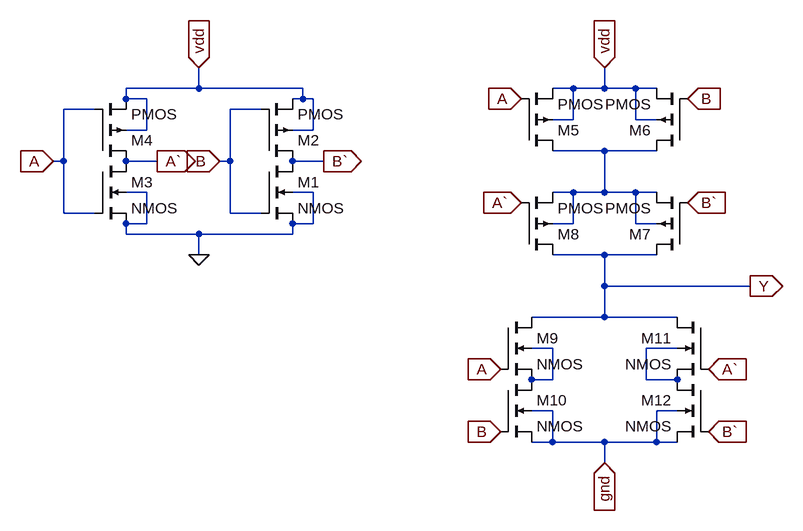
[diagram p0: schematic xor.asc]
xor.asc, the LTspice schematic file:
Version 4
SHEET 1 880 680
WIRE -320 -160 -320 -192
WIRE -320 -160 -432 -160
WIRE -160 -160 -320 -160
WIRE 256 -160 224 -160
WIRE 304 -160 304 -192
WIRE 304 -160 256 -160
WIRE 352 -160 304 -160
WIRE 384 -160 352 -160
WIRE -432 -144 -432 -160
WIRE -400 -144 -432 -144
WIRE -160 -144 -160 -160
WIRE -160 -144 -176 -144
WIRE -144 -144 -160 -144
WIRE -480 -128 -528 -128
WIRE -224 -128 -272 -128
WIRE 256 -112 256 -160
WIRE 256 -112 224 -112
WIRE 352 -112 352 -160
WIRE 384 -112 352 -112
WIRE -400 -96 -400 -144
WIRE -400 -96 -432 -96
WIRE -144 -96 -144 -144
WIRE -144 -96 -176 -96
WIRE 304 -64 224 -64
WIRE 384 -64 304 -64
WIRE -528 -48 -528 -128
WIRE -528 -48 -544 -48
WIRE -384 -48 -432 -48
WIRE -272 -48 -272 -128
WIRE -272 -48 -288 -48
WIRE -128 -48 -176 -48
WIRE -400 0 -432 0
WIRE -144 0 -176 0
WIRE 256 0 224 0
WIRE 304 0 304 -64
WIRE 304 0 256 0
WIRE 352 0 304 0
WIRE 384 0 352 0
WIRE -528 32 -528 -48
WIRE -480 32 -528 32
WIRE -272 32 -272 -48
WIRE -224 32 -272 32
WIRE -400 48 -400 0
WIRE -400 48 -432 48
WIRE -144 48 -144 0
WIRE -144 48 -176 48
WIRE 256 48 256 0
WIRE 256 48 224 48
WIRE 352 48 352 0
WIRE 384 48 352 48
WIRE -432 64 -432 48
WIRE -320 64 -432 64
WIRE -176 64 -176 48
WIRE -176 64 -320 64
WIRE -320 96 -320 64
WIRE 304 96 224 96
WIRE 384 96 304 96
WIRE 304 144 304 96
WIRE 528 144 304 144
WIRE 304 192 304 144
WIRE 304 192 192 192
WIRE 416 192 304 192
WIRE 224 240 192 240
WIRE 416 240 368 240
WIRE 224 288 224 240
WIRE 224 288 192 288
WIRE 368 288 368 240
WIRE 416 288 368 288
WIRE 224 336 192 336
WIRE 416 336 384 336
WIRE 224 384 224 336
WIRE 224 384 192 384
WIRE 304 384 224 384
WIRE 384 384 384 336
WIRE 384 384 304 384
WIRE 416 384 384 384
WIRE 304 416 304 384
FLAG -384 -48 A`
IOPIN -384 -48 Out
FLAG -128 -48 B`
IOPIN -128 -48 Out
FLAG 304 -192 vdd
IOPIN 304 -192 In
FLAG 176 -144 A
IOPIN 176 -144 In
FLAG -320 -192 vdd
IOPIN -320 -192 In
FLAG -320 96 0
FLAG -544 -48 A
IOPIN -544 -48 In
FLAG -288 -48 B
IOPIN -288 -48 In
FLAG 528 144 Y
IOPIN 528 144 Out
FLAG 432 -144 B
IOPIN 432 -144 In
FLAG 144 368 B
IOPIN 144 368 In
FLAG 176 16 A`
IOPIN 176 16 In
FLAG 464 272 A`
IOPIN 464 272 In
FLAG 432 16 B`
IOPIN 432 16 In
FLAG 464 368 B`
IOPIN 464 368 In
FLAG 144 272 A
IOPIN 144 272 In
FLAG 304 416 gnd
IOPIN 304 416 In
SYMBOL nmos4 -224 -48 R0
SYMATTR InstName M1
SYMBOL pmos4 -224 -48 M180
SYMATTR InstName M2
SYMBOL nmos4 -480 -48 R0
SYMATTR InstName M3
SYMBOL pmos4 -480 -48 M180
SYMATTR InstName M4
SYMBOL pmos4 176 -64 M180
SYMATTR InstName M5
SYMBOL pmos4 432 -64 R180
SYMATTR InstName M6
SYMBOL pmos4 432 96 R180
SYMATTR InstName M7
SYMBOL pmos4 176 96 M180
SYMATTR InstName M8
SYMBOL nmos4 144 192 R0
SYMATTR InstName M9
SYMBOL nmos4 144 288 R0
SYMATTR InstName M10
SYMBOL nmos4 464 192 M0
SYMATTR InstName M11
SYMBOL nmos4 464 288 M0
SYMATTR InstName M12

The netlist it stands for:
* xor.asc
M1 B` B 0 0 NMOS
M2 B` B vdd vdd PMOS
M3 A` A 0 0 NMOS
M4 A` A vdd vdd PMOS
M5 N001 A vdd vdd PMOS
M6 N001 B vdd vdd PMOS
M7 Y B` N001 N001 PMOS
M8 Y A` N001 N001 PMOS
M9 Y A N002 N002 NMOS
M10 N002 B gnd gnd NMOS
M11 Y A` N003 N003 NMOS
M12 N003 B` gnd gnd NMOS
.model NMOS NMOS
.model PMOS PMOS
.lib standard.mos
.backanno
.end